# Altium schematic sheet POWER_REG.SchDoc
size B
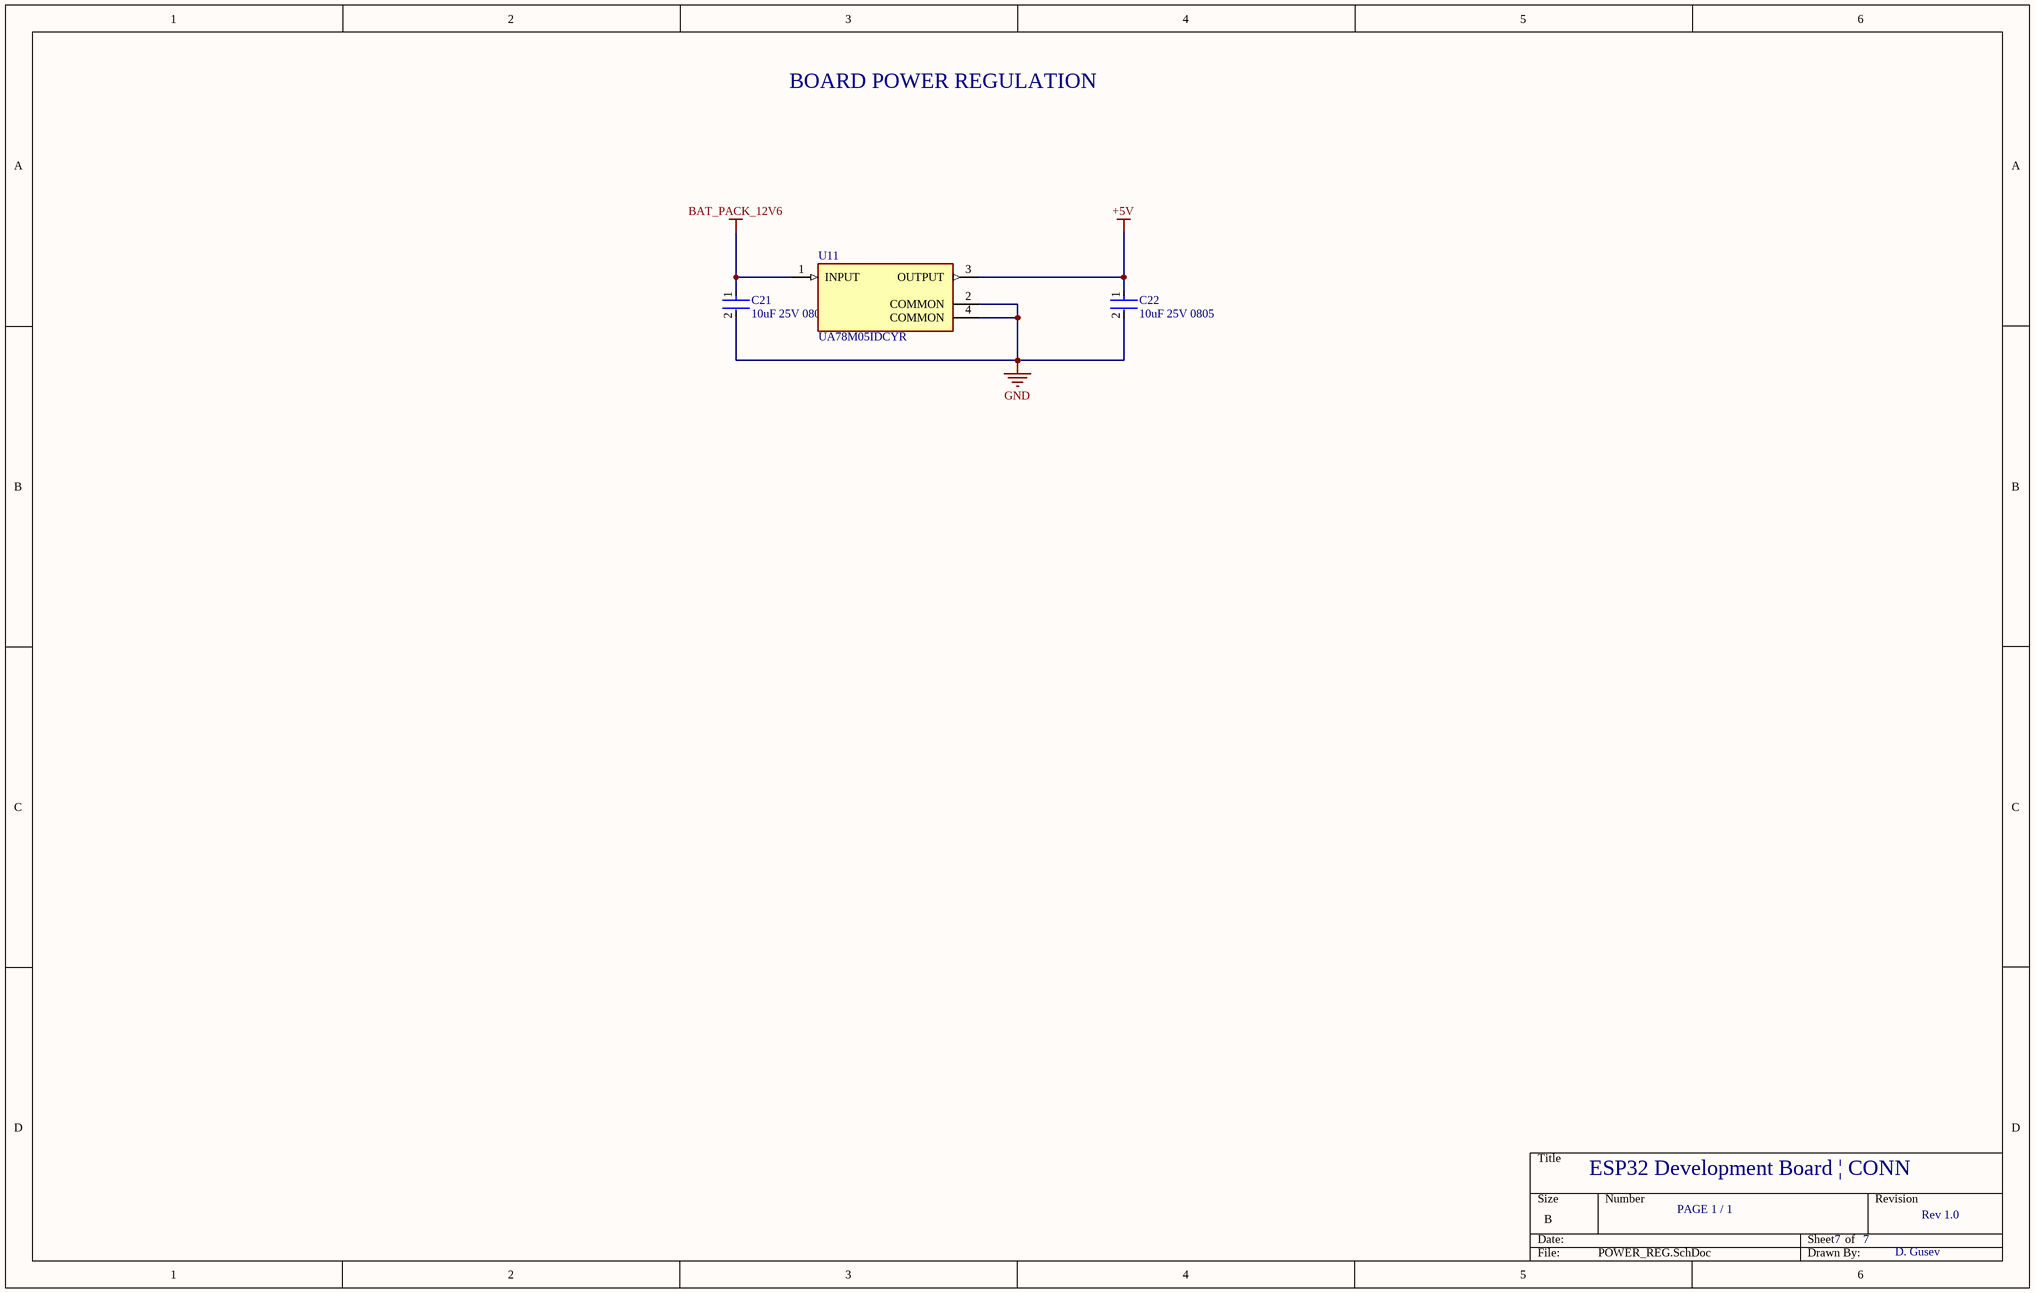
[diagram p0: POWER_REG.SchDoc]

## Parts
C21  10uF 25V 0805  [FP-GRM21B-0_15-IPC_C]
C22  10uF 25V 0805  [FP-GRM21B-0_15-IPC_C]
U11  UA78M05IDCYR  [FP-DCY0004A-MFG]

## Nets
+5V: C22.1 U11.3(OUTPUT)
BAT_PACK_12V6: C21.1 U11.1(INPUT)
GND: C21.2 C22.2 U11.2(COMMON) U11.4(COMMON)

## Notes on the sheet
- BOARD POWER REGULATION
- ESP32 Development Board | CONN
- PAGE 1 / 1
- 7
- Rev 1.0
- D. Gusev

## Library data of the parts
C21 C22 = CMP-2007-03541-2: Chip Multilayer Ceramic Capacitors for General Purpose, 0805, 10uF, X5R, 15%, 10%, 25V; Length: 2mm; Depth: 1.25mm; Termination: SMD/SMT; Voltage: 25V; Height: 1.25mm; Material: Ceramic; Thickness: 0.053inch; Radiation Hardening: No; Min Operating Temperature: -55°C; Width: 0.049inch; Package Quantity: 1; Mount: Surface Mount; Dielectric: X5R; Packaging: Tape and Reel; Capacitance: 10uF; Voltage Rating (DC): 25V; Lead Free: Lead Free; Max Operating Temperature: 85°C; Case Code (Imperial): 0805; Case/Package: 0805; Tolerance: 10%; Voltage Rating: 25V; Case Code (Metric): 2012
U11 = CMP-04917-000030-1: IC REG LINEAR 5V 500MA SOT223-4; Manufacturer: Texas Instruments; Min Supply Voltage: 7V; Number Of Outputs: 1; Dropout Voltage: 2V; Max Supply Voltage: 25V; Output Type: Fixed; Max Junction Temp: +125°C; Standoff Height: 0.02mm; Automotive: No; Temperature Range Low: -40°C; Temperature Range High: +125°C; Package: DCY0004A; Lead Free: Yes; Octopart: https://octopart.com/ua78m05idcyr-texas+instruments-525575; Output Current: 500mA; ComponentLink2URL: http://www.ti.com/lit/ds/symlink/ua78m.pdf; Mouser Description: Linear Voltage Regulators 5V 500mA Fixed Pos Voltage Regulator; Device Class L1: Integrated Circuits (ICs); Device Class L3: Voltage Regulators - Linear; RoHS: TRUE; ComponentLink2Description: Datasheet; Output Voltage: 5V; Height: 1.8mm; Temperature: -40°C to +125°C; Manufacturer Part Number: UA78M05IDCYR; Digikey Description: IC REG LINEAR 5V 500MA SOT223-4; Category: IC; Device Class L2: Power Management ICs; Ipc Land Pattern Name: SOT230P700X180-4